# Altium schematic sheet 000_TOP.SchDoc
size Letter; SheetNumber: 1; SheetTotal: 5
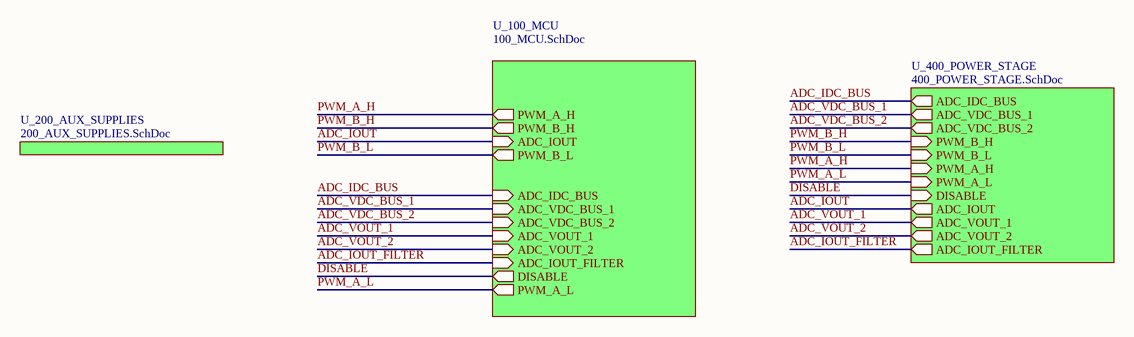
[diagram p0: 000_TOP.SchDoc]

## Sub-sheets
U_100_MCU = 100_MCU.SchDoc: PWM_A_H (out), PWM_B_H (out), ADC_IOUT (in), PWM_B_L (out), ADC_IDC_BUS (in), ADC_VDC_BUS_1 (in), ADC_VDC_BUS_2 (in), ADC_VOUT_1 (in), ADC_VOUT_2 (in), ADC_IOUT_FILTER (in), DISABLE (out), PWM_A_L (out)
U_200_AUX_SUPPLIES = 200_AUX_SUPPLIES.SchDoc: no entries
U_400_POWER_STAGE = 400_POWER_STAGE.SchDoc: ADC_IDC_BUS (out), ADC_VDC_BUS_1 (out), ADC_VDC_BUS_2 (out), PWM_B_H (in), PWM_B_L (in), PWM_A_H (in), PWM_A_L (in), DISABLE (in), ADC_IOUT (out), ADC_VOUT_1 (out), ADC_VOUT_2 (out), ADC_IOUT_FILTER (out)

## Nets
ADC_IDC_BUS: sheet U_400_POWER_STAGE/ADC_IDC_BUS, sheet U_100_MCU/ADC_IDC_BUS
ADC_IOUT: sheet U_400_POWER_STAGE/ADC_IOUT, sheet U_100_MCU/ADC_IOUT
ADC_IOUT_FILTER: sheet U_400_POWER_STAGE/ADC_IOUT_FILTER, sheet U_100_MCU/ADC_IOUT_FILTER
ADC_VDC_BUS_1: sheet U_400_POWER_STAGE/ADC_VDC_BUS_1, sheet U_100_MCU/ADC_VDC_BUS_1
ADC_VDC_BUS_2: sheet U_400_POWER_STAGE/ADC_VDC_BUS_2, sheet U_100_MCU/ADC_VDC_BUS_2
ADC_VOUT_1: sheet U_400_POWER_STAGE/ADC_VOUT_1, sheet U_100_MCU/ADC_VOUT_1
ADC_VOUT_2: sheet U_400_POWER_STAGE/ADC_VOUT_2, sheet U_100_MCU/ADC_VOUT_2
DISABLE: sheet U_400_POWER_STAGE/DISABLE, sheet U_100_MCU/DISABLE
PWM_A_H: sheet U_400_POWER_STAGE/PWM_A_H, sheet U_100_MCU/PWM_A_H
PWM_A_L: sheet U_400_POWER_STAGE/PWM_A_L, sheet U_100_MCU/PWM_A_L
PWM_B_H: sheet U_400_POWER_STAGE/PWM_B_H, sheet U_100_MCU/PWM_B_H
PWM_B_L: sheet U_400_POWER_STAGE/PWM_B_L, sheet U_100_MCU/PWM_B_L